# Altium project Placa E3.PrjPcb
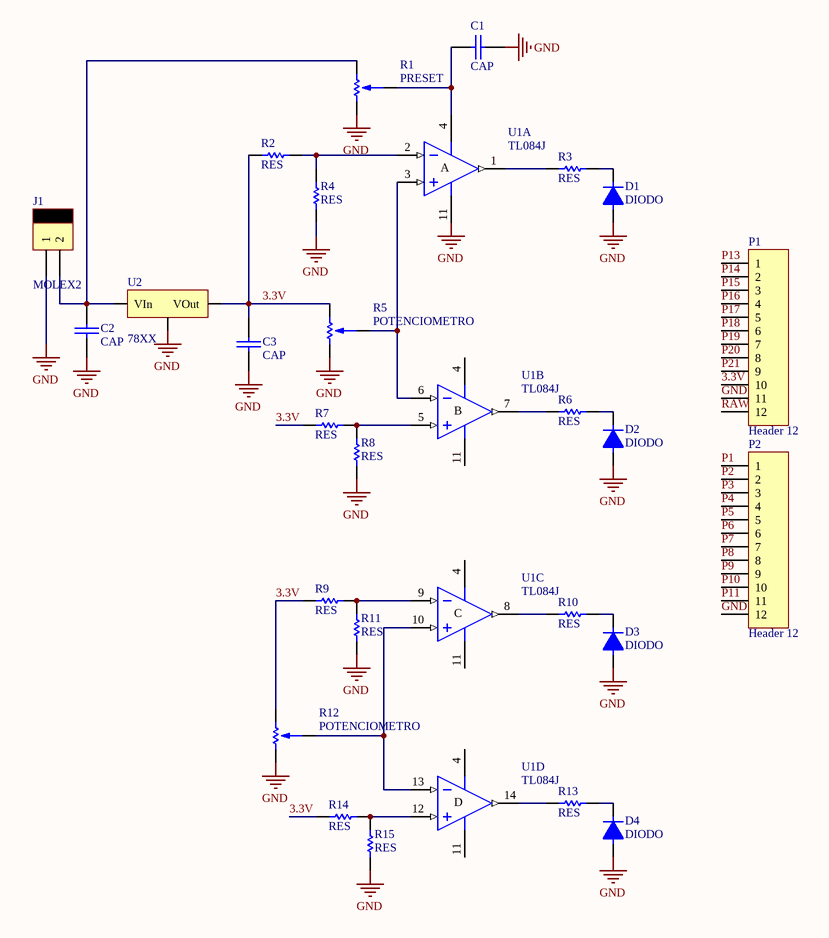
[diagram p0: PlacaE3.SchDoc]
1 sheet, 27 parts. Net scope: global (net labels, ports and power ports of the same name join across sheets).
Board file: PlacaE3.PcbDoc

## Sheet PlacaE3.SchDoc
size A4

### Parts
C1  CAP  [CAP200]
C2  CAP  [CAP200]
C3  CAP  [CAP200]
D1  DIODO  [DO41]
D2  DIODO  [DO41]
D3  DIODO  [DO41]
D4  DIODO  [DO41]
J1  MOLEX2  [MOLEX2]
P1  Header 12  [HDR1X12]
P2  Header 12  [HDR1X12]
R1  PRESET  [PRESET V]
R2  RES  [RES400]
R3  RES  [RES400]
R4  RES  [RES400]
R5  POTENCIOMETRO  [POTENCIOMETRO]
R6  RES  [RES400]
R7  RES  [RES400]
R8  RES  [RES400]
R9  RES  [RES400]
R10  RES  [RES400]
R11  RES  [RES400]
R12  POTENCIOMETRO  [POTENCIOMETRO]
R13  RES  [RES400]
R14  RES  [RES400]
R15  RES  [RES400]
U1  TL084J  [J014]  (parts A,B,C,D of 4)
U2  78XX  [TO-220 V]

### Nets
GND: C1.2 C2.2 C3.2 D1.1 D2.1 D3.1 D4.1 J1.1 P1.11 P2.12 R1.3 R4.1 R5.3 R8.1 R11.1 R12.3 R15.1 U1.11(V-) U2.2(GND)
3.3V: C3.1 P1.10 R2.1 R5.1 R7.1 R9.1 R12.1 R14.1 U2.3(VOut)
P1: P2.1
P2: P2.2
P3: P2.3
P4: P2.4
P5: P2.5
P6: P2.6
P7: P2.7
P8: P2.8
P9: P2.9
P10: P2.10
P11: P2.11
P13: P1.1
P14: P1.2
P15: P1.3
P16: P1.4
P17: P1.5
P18: P1.6
P19: P1.7
P20: P1.8
P21: P1.9
RAW: P1.12
NetC1_1: C1.1 R1.2 U1.4(V+)
NetC2_1: C2.1 J1.2 R1.1 U2.1(VIn)
NetD1_2: D1.2 R3.2
NetD2_2: D2.2 R6.2
NetD3_2: D3.2 R10.2
NetD4_2: D4.2 R13.2
NetR2_2: R2.2 R4.2 U1.2(IN-)
NetR3_1: R3.1 U1.1(OUT)
NetR5_2: R5.2 U1.3(IN+) U1.6(IN-)
NetR6_1: R6.1 U1.7(OUT)
NetR7_2: R7.2 R8.2 U1.5(IN+)
NetR9_2: R9.2 R11.2 U1.9(IN-)
NetR10_1: R10.1 U1.8(OUT)
NetR12_2: R12.2 U1.10(IN+) U1.13(IN-)
NetR13_1: R13.1 U1.14(OUT)
NetR14_2: R14.2 R15.2 U1.12(IN+)

### Notes on the sheet
- (in symbol TL084J, part A) A
- (in symbol TL084J, part B) B
- (in symbol TL084J, part C) C
- (in symbol TL084J, part D) D

### Library data of the parts
P1 P2 = Header 12: Header, 12-Pin; LatestRevisionDate: 17-Jul-2002; LatestRevisionNote: Re-released for DXP Platform.; Publisher: Altium Limited
U1 = TL084J: JFET-Input Operational Amplifier; Published: 16-Jan-2001; LatestRevisionDate: 04-Mar-2005; LatestRevisionNote: Stylized 3D Model Added.; DatasheetVersion: Feb-1999; PackageVersion: Jun-1999; PackageReference: J014; Publisher: Altium Limited; PackageDescription: DIP; 14 Leads; Row Spacing 7.62 mm; Pitch 2.54 mm; ComponentLink1Description: Manufacturer Link; ComponentLink1URL: http://www.ti.com/; ComponentLink2Description: Datasheet; ComponentLink2URL: http://www-s.ti.com/sc/ds/tl084.pdf
U2 = 78XX: REGULDOR POSITIVO